# EAGLE design Teensy3 based M&M board V2 (EAGLE 6.4)
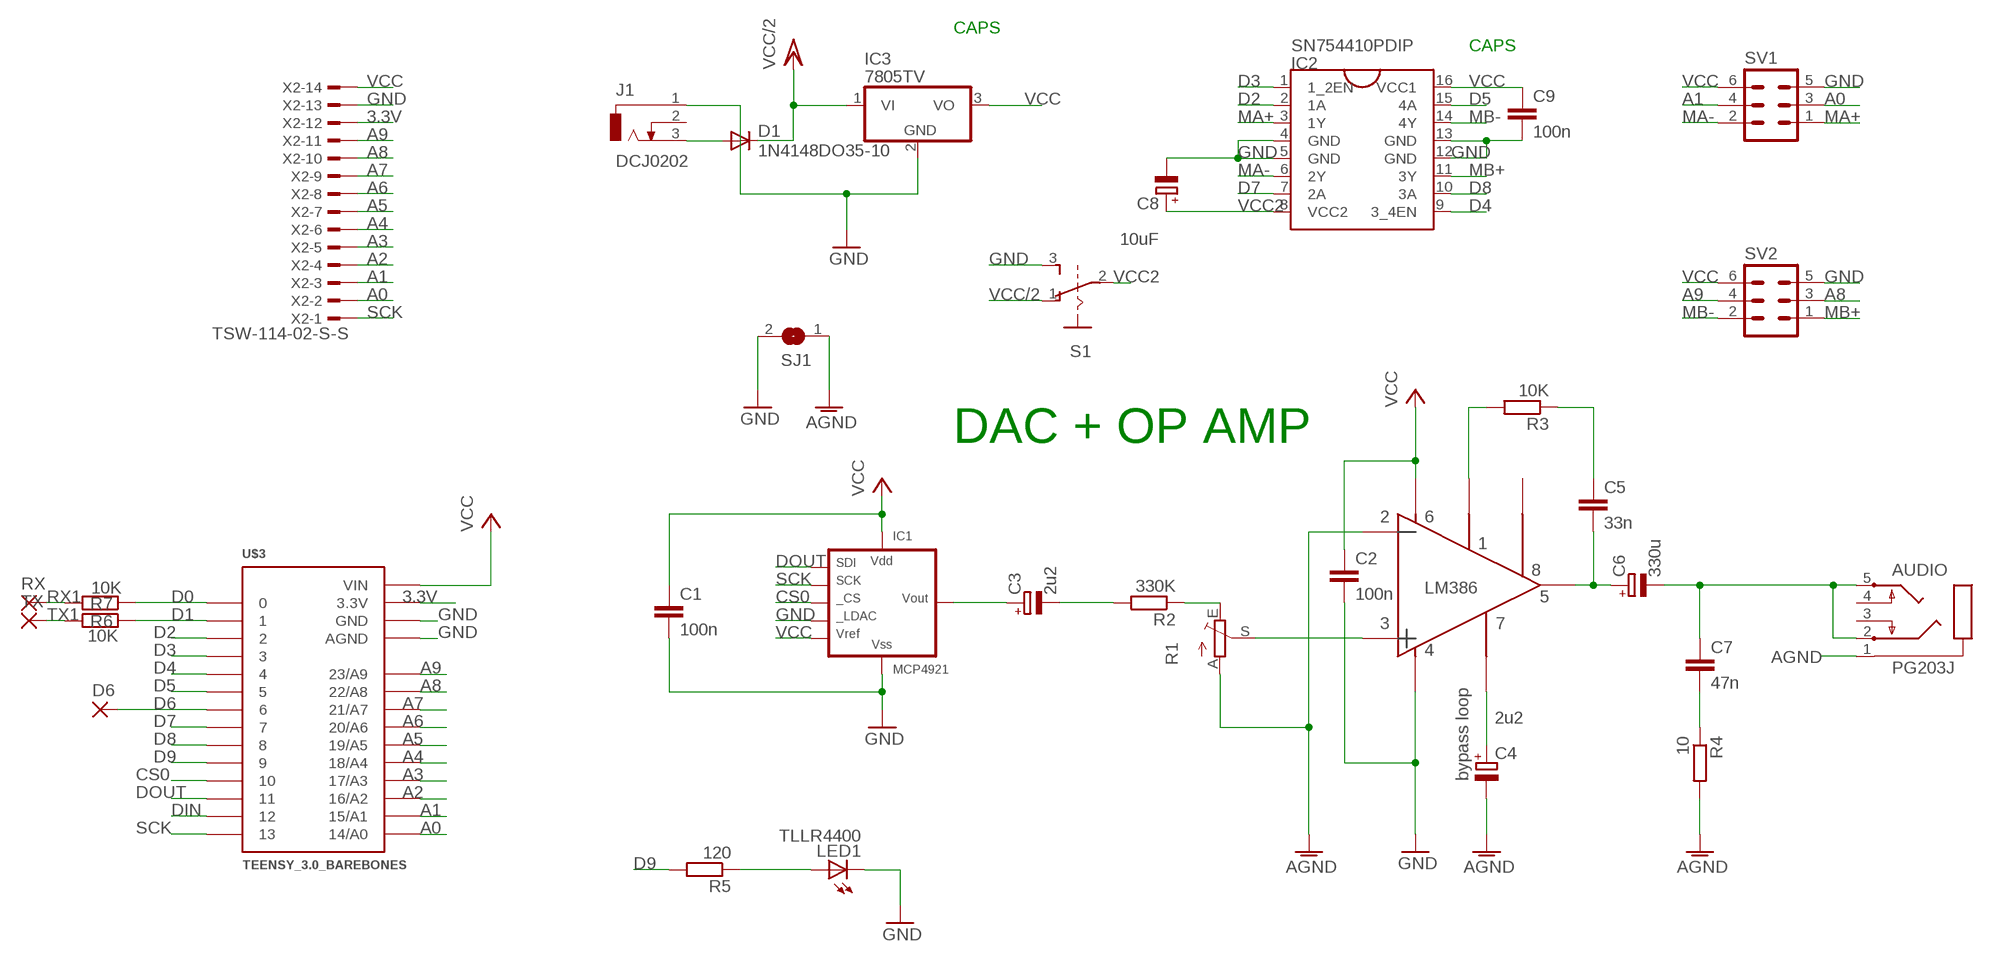
[diagram p0: schematic, sheet 1]

## Parts
AUDIO  PG203J  [PG203J]
C1  100n  C-EU050-030X075  [C050-030X075]
C2  100n  C-EU050-030X075  [C050-030X075]
C3  2u2  CPOL-EUE2-5  [E2-5]
C4  2u2  CPOL-EUE2-5  [E2-5]
C5  33n  C-EU050-030X075  [C050-030X075]
C6  330u  CPOL-EUE2.5-7  [E2,5-7]
C7  47n  C-EU050-030X075  [C050-030X075]
C8  10uF  CPOL-EUE2-5  [E2-5]
C9  100n  C-EU050-030X075  [C050-030X075]
D1  1N4148DO35-10  [DO35-10]
D6  2,15/1,0  [2,15/1,0]
IC1  MCP4921  MCP4921P  [DIL8]
IC2  SN754410PDIP  [DIL16]
IC3  7805TV  [TO220V]
J1  DCJ0202  [DCJ0202]
LED1  TLLR4400  [LED3MM]
R1  TRIM_EU-CA9V  [CA9V]
R2  330K  R-EU_0207/10  [0207/10]
R3  10K  R-EU_0207/10  [0207/10]
R4  10  R-EU_0207/10  [0207/10]
R5  120  R-EU_0207/10  [0207/10]
R6  10K  R-EU_0207/10  [0207/10]
R7  10K  R-EU_0207/10  [0207/10]
RX  2,15/1,0  [2,15/1,0]
S1  EG1218  [GF-126-0159]
SJ1  SJ  [SJ]
SV1  ML6  [ML6]
SV2  ML6  [ML6]
TX  2,15/1,0  [2,15/1,0]
U$2  LM386  LM386OA  [LM386]
U$3  TEENSY_3.0_BAREBONES  [TEENSY_3.0_BAREBONES]
X2  TSW-114-02-S-S  [TSW-114-02-S-S]

## Nets
3.3V [power]: U$3.3.3V X2.12
A0: SV1.3 U$3.14/A0 X2.2
A1: SV1.4 U$3.15/A1 X2.3
A2: U$3.16/A2 X2.4
A3: U$3.17/A3 X2.5
A4: U$3.18/A4 X2.6
A5: U$3.19/A5 X2.7
A6: U$3.20/A6 X2.8
A7: U$3.21/A7 X2.9
A8: SV2.3 U$3.22/A8 X2.10
A9: SV2.4 U$3.23/A9 X2.11
AGND [power]: AUDIO.1 C4.- R1.A R4.2 SJ1.1 U$2.2
AMP_IN: R1.S U$2.3
CS0: IC1.2(CS) U$3.10
D0: R7.1 U$3.0
D1: R6.1 U$3.1
D2: IC2.2(1A) U$3.2
D3: IC2.1(1_2EN) U$3.3
D4: IC2.9(3_4EN) U$3.4
D5: IC2.15(4A) U$3.5
D6: D6.1(P) U$3.6
D7: IC2.7(2A) U$3.7
D8: IC2.10(3A) U$3.8
D9: R5.2 U$3.9
DAC_OUT: C3.+ IC1.8(VOUT)
DIN: U$3.12
DOUT: IC1.4(SDI) U$3.11
GND [power]: C1.2 C2.2 C8.- C9.2 IC1.5(LDAC) IC1.7(VSS) IC2.4(GND) IC2.5(GND) IC2.12(GND) IC2.13(GND) IC3.2(GND) J1.1 LED1.K(C) S1.3 SJ1.2 SV1.5 SV2.5 U$2.4 U$3.AGND U$3.GND X2.13
MA+: IC2.3(1Y) SV1.1
MA-: IC2.6(2Y) SV1.2
MB+: IC2.11(3Y) SV2.1
MB-: IC2.14(4Y) SV2.2
N$1: D1.A J1.3
N$2: R3.2 U$2.1
N$3: C3.- R2.2
N$4: R1.E R2.1
N$5: LED1.A R5.1
N$9: C5.1 R3.1
N$10: C4.+ U$2.7
N$78: C7.2 R4.1
N$84: AUDIO.2 AUDIO.5 C6.- C7.1
N$99: C5.2 C6.+ U$2.5
RX1: R7.2 RX.1(P)
SCK: IC1.3(SCK) U$3.13 X2.1
TX1: R6.2 TX.1(P)
VCC [power]: C1.1 C2.1 C9.1 IC1.1(VDD) IC1.6(VREF) IC2.16(VCC1) IC3.3(VO) SV1.6 SV2.6 U$2.6 U$3.VIN X2.14
VCC2: C8.+ IC2.8(VCC2) S1.2
VCC/2: D1.C IC3.1(VI) S1.1
Unconnected: AUDIO.3 AUDIO.4 J1.2 U$2.8

## Notes on the sheet
- CAPS
- CAPS
- DAC + OP AMP
- bypass loop

## Library data of the parts
AUDIO = con-hirschmann:PG203J: MIC/HEADPHONE JACK KS-S stereo microphone/headphone jack PG203JN (Schukat)
C1 C2 C5 C7 C9 = rcl:C-EU: CAPACITOR, European symbol
C3 C4 C6 C8 = rcl:CPOL-EU: POLARIZED CAPACITOR, European symbol
D1 = diode:1N4148: DIODE high speed (Philips)
D6 RX TX = wirepad:2,15/1,0: THROUGH-HOLE PAD
IC1 = microchip-dac:MCP4921: MCP4921: 12-bit DAC MCP4901/4911/4921 - 8/10/12-Bit Voltage Output Digital-to-Analog Converter with SPI Interface Interface The MCP49x1 devices are single channel 8-bit, 10-bit and 12-bit buffered voltage output Digital-to-Analog Converters (DACs), respectively. The devices operate from a single 2.7V to 5.5V supply with an SPI compatible Serial Peripheral Interface. The user can configure the full-scale range of the device to be VREF or 2*VREF by setting the Gain Selection Option bit (gain of 1 of 2). RobG
IC2 = AlexW-Eagle-Libraries:SN754410
IC3 = linear:78*: Positive VOLTAGE REGULATOR Source: http://cache.national.com/ds/LM/LM78L05.pdf http://www.fairchildsemi.com/ds/LM/LM7805.pdf
J1 = con-jack:DCJ0202: DC POWER JACK Source: DCJ0202.pdf; OC_FARNELL: unknown; OC_NEWARK: unknown
LED1 = led:TLLR4400: Low Current (2mA) LED 3 mm Tinted Diffused Package color RED Source: Data sheet <http://www.farnell.com/datasheets/391100.pdf>; MF: VISHAY SEMICONDUCTOR; OC_FARNELL: 1612437
R1 = pot:TRIM_EU-: POTENTIOMETER
R2-R7 = rcl:R-EU_: RESISTOR, European symbol
S1 = videomusik:EG1218
SJ1 = jumper:SJ: SMD solder JUMPER
SV1 SV2 = con-harting-ml:ML6: HARTING; OC_FARNELL: unknown; OC_NEWARK: unknown
U$2 = blushingboy_experimental:LM386
U$3 = Teensy3.0:TEENSY_3.0_BAREBONES
X2 = con-samtec:TSW-114-02-S-S: THROUGH-HOLE .025" SQ POST HEADER Source: Samtec TSW.pdf; OC_FARNELL: unknown; OC_NEWARK: unknown

## Net classes
1 power: width 0.61 mm

## Board
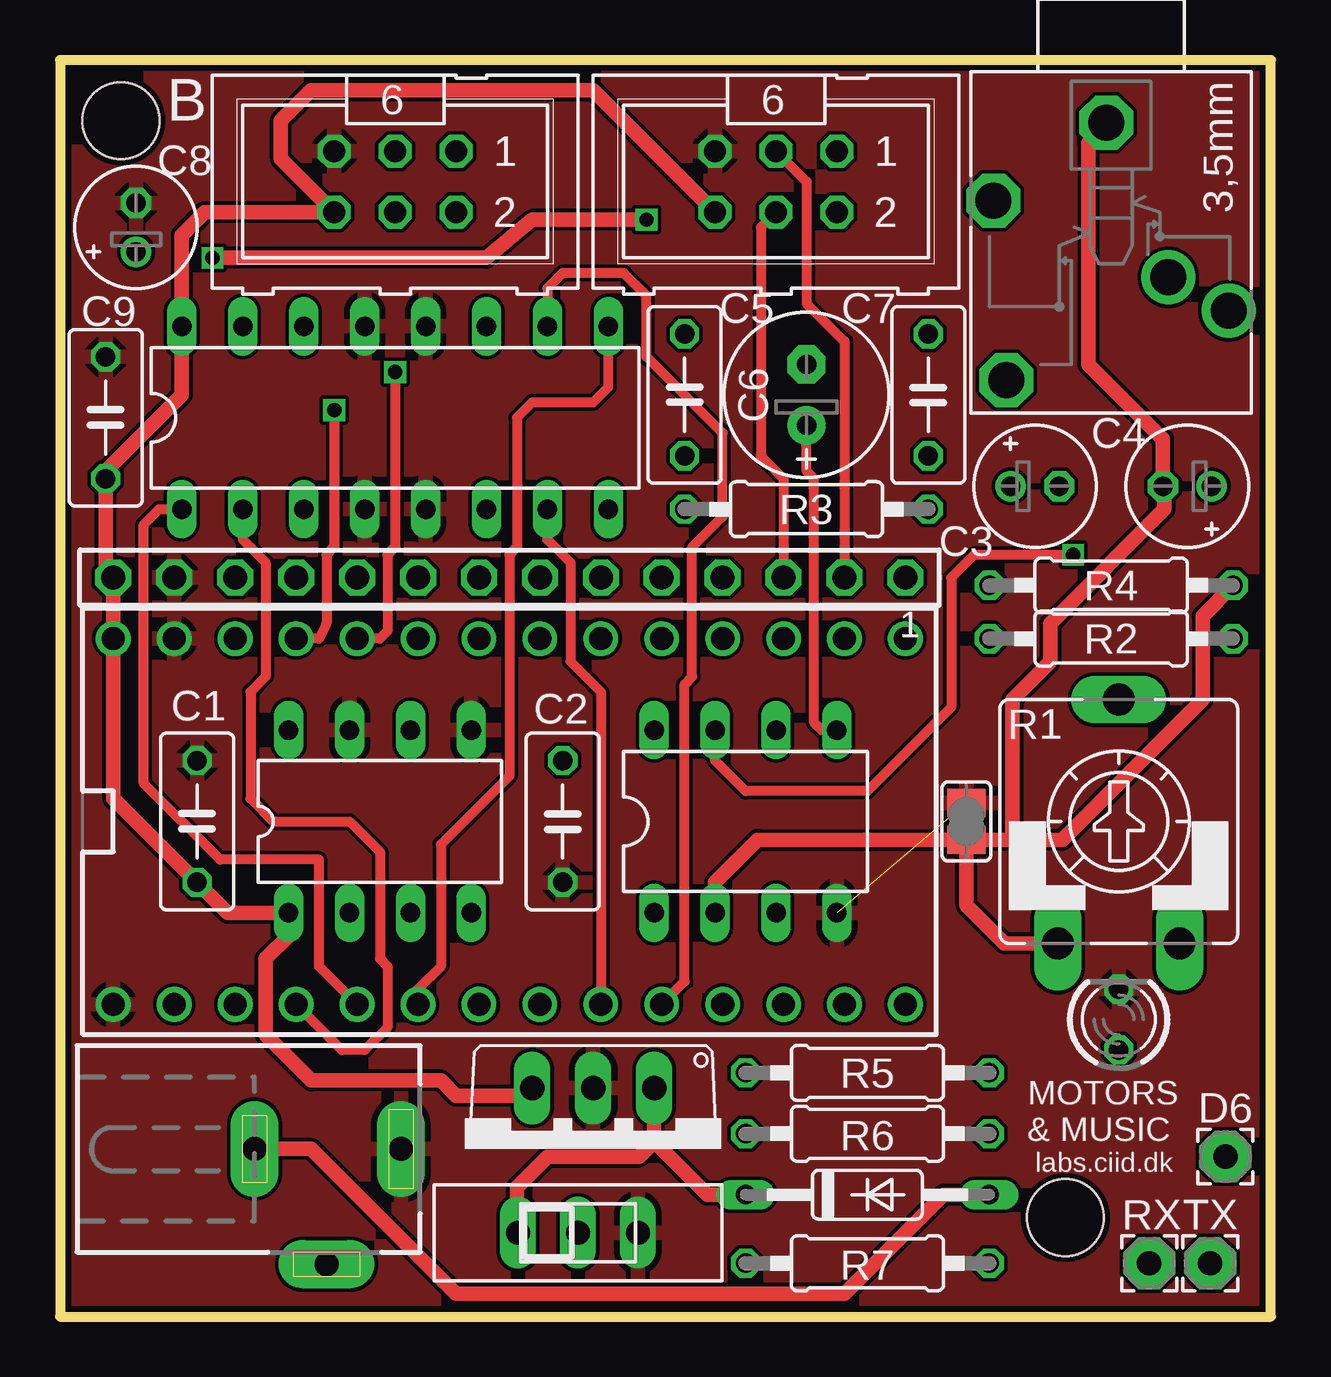
[diagram p1: board, top side]
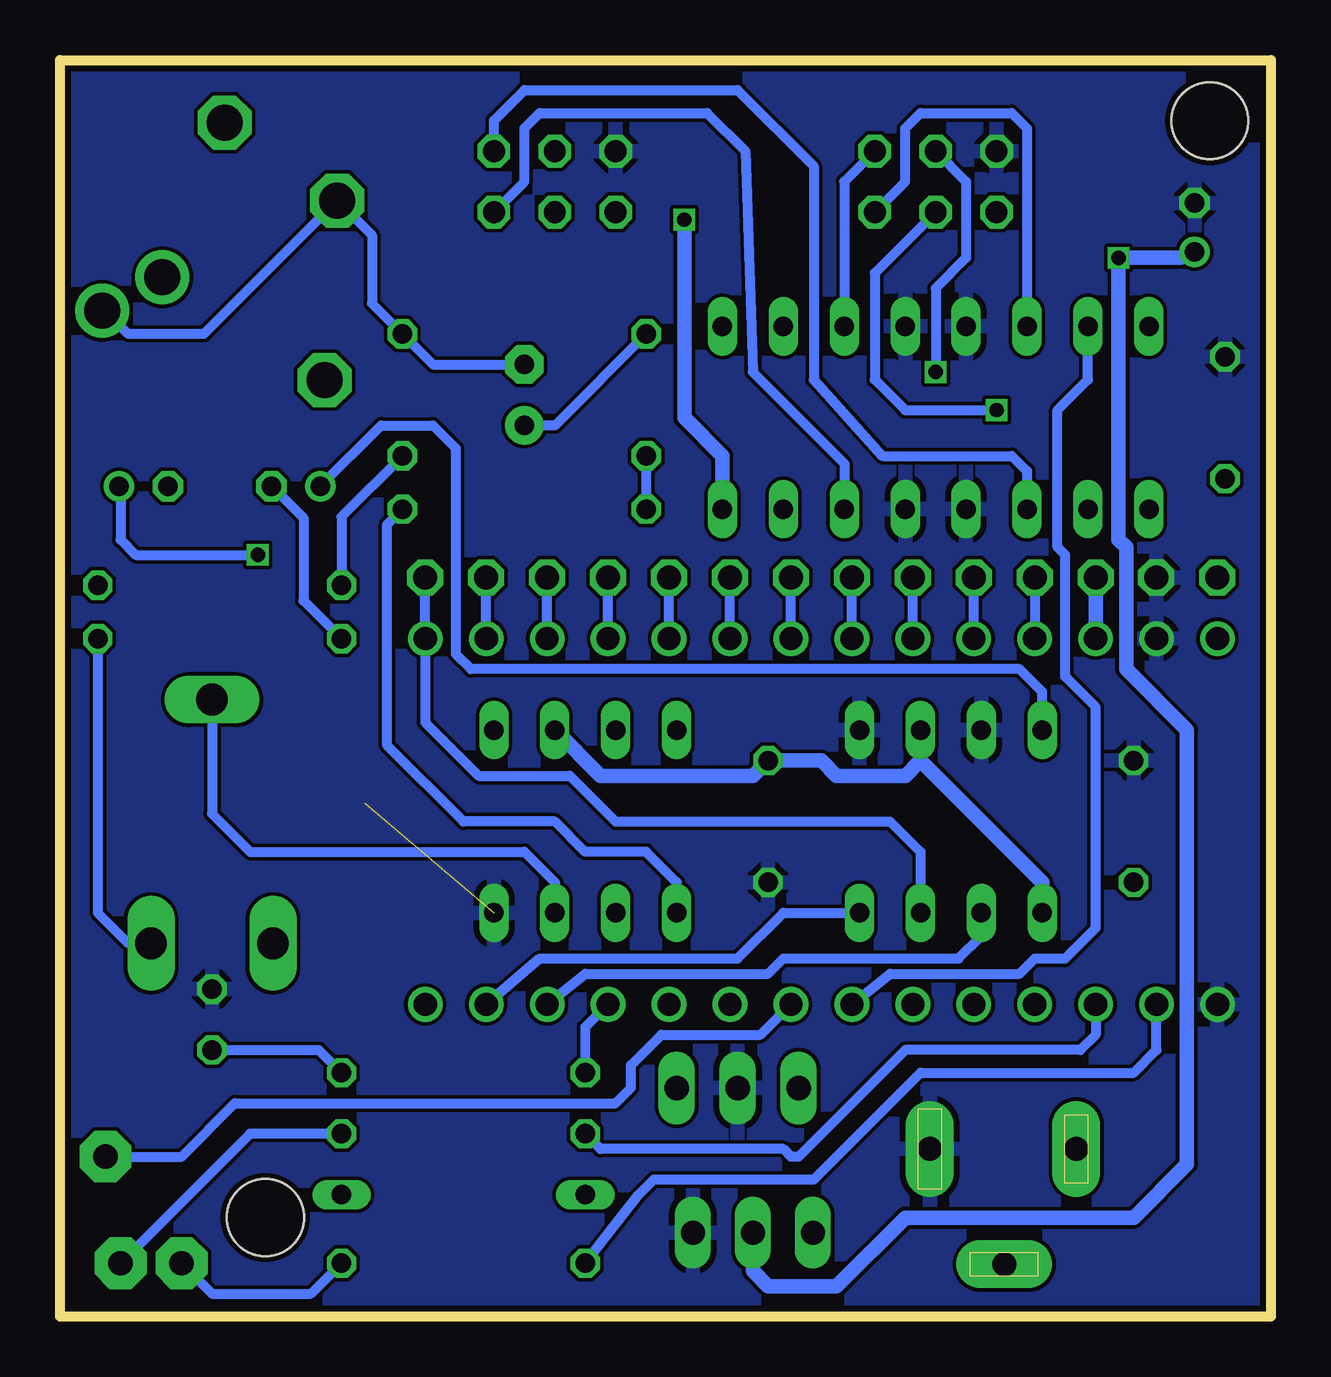
[diagram p2: board, bottom side, seen from below]

Size 50.47 x 52.38 mm. Coordinates in mm from the lower left corner, seen from the top.
Outline: 0,0 50.47,0 50.47,52.38 0,52.38 0,0
Copper layers (1*2*15*16): Top 0.035mm / dielectric 0.2mm / layer 2 0.0175mm / dielectric 1.1mm / layer 15 0.0175mm / dielectric 0.2mm / Bottom 0.035mm
Design rules "SeeedStudio_DRU_no_angle_20130527": minimum track width 6mil, minimum drill 12mil, track to track 6mil, track to pad 6mil, pad to pad 6mil, via to via 6mil, smd to smd 0mil, copper to edge 10mil, drill to drill 10mil, minimum pad ring 6mil, minimum via ring 6mil, stop-mask expansion 2mil, vias tented up to drill 25mil, thermal gap 10mil
Holes 3.2 mm at 2.54,49.85 41.91,4.13

### Footprints (pad centres in the part's own frame; a part is rotated, then mirrored left to right if it is on the bottom)
PG203J = drill 1.499 octagon: 1 -5.004,-0.203; 4 5.74,-4.369; 5 -1.753,-4.902 | drill 1.499: 2 2.845,4.902; 3 1.448,2.388
C050-030X075 = drill 0.813 octagon: 1 -2.54,0; 2 2.54,0
E2-5 = drill 0.813 pad 1.27: + -1.016,0 | drill 0.813 pad 1.27 octagon: - 1.016,0
E2,5-7 = drill 0.813 pad 1.6: + -1.27,0 | drill 0.813 pad 1.6 octagon: - 1.27,0
DO35-10 = drill 0.813 long: A 5.08,0; C -5.08,0
2,15/1,0 = drill 1.016 pad 2.159 octagon: 1 0,0
DIL8 = drill 0.813 long: 1 -3.81,-3.81; 2 -1.27,-3.81; 3 1.27,-3.81; 4 3.81,-3.81; 5 3.81,3.81; 6 1.27,3.81; 7 -1.27,3.81; 8 -3.81,3.81
DIL16 = drill 0.813 long: 1 -8.89,-3.81; 2 -6.35,-3.81; 3 -3.81,-3.81; 4 -1.27,-3.81; 5 1.27,-3.81; 6 3.81,-3.81; 7 6.35,-3.81; 8 8.89,-3.81; 9 8.89,3.81; 10 6.35,3.81; 11 3.81,3.81; 12 1.27,3.81; 13 -1.27,3.81; 14 -3.81,3.81; 15 -6.35,3.81; 16 -8.89,3.81
TO220V = drill 1.016 long: 1 -2.54,-2.54; 2 0,-2.54; 3 2.54,-2.54
DCJ0202 = drill 1 pad 2 long: 1 0,3.1; 2 4.8,0; 3 0,-3
LED3MM = drill 0.813 octagon: A -1.27,0; K 1.27,0
CA9V = drill 1.321 long: A -2.54,-5.08; E 2.54,-5.08; S 0,5.08
0207/10 = drill 0.813 octagon: 1 -5.08,0; 2 5.08,0
GF-126-0159 = drill 1 long: 1 -2.5,0; 2 0,0; 3 2.5,0
SJ = smd 1.168 x 1.6: 1 -0.762,0; 2 0.762,0
ML6 = drill 0.914 octagon: 1 -2.54,-1.27; 2 -2.54,1.27; 3 0,-1.27; 4 0,1.27; 5 2.54,-1.27; 6 2.54,1.27
LM386 = drill 0.813 long: 1 2.54,-2.54; 2 5.08,-2.54; 3 7.62,-2.54; 4 10.16,-2.54; 5 10.16,5.08; 6 7.62,5.08; 7 5.08,5.08; 8 2.54,5.08
TEENSY_3.0_BAREBONES = drill 0.965: 0 -7.62,13.97; 1 -7.62,11.43; 2 -7.62,8.89; 3 -7.62,6.35; 3.3V 7.62,11.43; 4 -7.62,3.81; 5 -7.62,1.27; 6 -7.62,-1.27; 7 -7.62,-3.81; 8 -7.62,-6.35; 9 -7.62,-8.89; 10 -7.62,-11.43; 11 -7.62,-13.97; 12 -7.62,-16.51; 13 7.62,-16.51; 14/A0 7.62,-13.97; 15/A1 7.62,-11.43; 16/A2 7.62,-8.89; 17/A3 7.62,-6.35; 18/A4 7.62,-3.81; 19/A5 7.62,-1.27; 20/A6 7.62,1.27; 21/A7 7.62,3.81; 22/A8 7.62,6.35; 23/A9 7.62,8.89; AGND 7.62,13.97; GND -7.62,16.51; VIN 7.62,16.51
TSW-114-02-S-S = drill 1 pad 1.5 octagon: 1 16.51,0; 2 13.97,0; 3 11.43,0; 4 8.89,0; 5 6.35,0; 6 3.81,0; 7 1.27,0; 8 -1.27,0; 9 -3.81,0; 10 -6.35,0; 11 -8.89,0; 12 -11.43,0; 13 -13.97,0; 14 -16.51,0

### Placement (x,y rotation side)
AUDIO  43.81,44.77 270 top
C1  5.71,20.64 90 top
C2  20.95,20.64 270 top
C3  40.64,34.61 0 top
C4  46.99,34.61 180 top
C5  26.04,38.42 90 top
C6  31.11,38.42 90 top
C7  36.2,38.42 270 top
C8  3.17,45.4 90 top
C9  1.91,37.47 90 top
D1  33.66,5.08 0 top
D6  48.58,6.67 0 top
IC1  13.34,20.64 0 top
IC2  13.97,37.47 0 top
IC3  22.23,6.99 180 top
J1  11.11,6.99 270 top
LED1  44.13,12.38 90 top
R1  44.13,20.64 0 top
R2  43.81,28.26 180 top
R3  31.11,33.66 0 top
R4  43.81,30.48 0 top
R5  33.66,10.16 180 top
R6  33.66,7.62 0 top
R7  33.66,2.22 0 top
RX  45.4,2.22 0 top
S1  21.59,3.49 0 top
SJ1  37.78,20.64 90 top
SV1  29.84,47.31 180 top
SV2  13.97,47.31 180 top
TX  47.94,2.22 0 top
U$2  22.23,19.37 0 top
U$3  18.73,20.64 90 top
X2  18.73,30.8 0 top

### Tracks (layer width: path | path; a pad name or v marks a point on that pad's centre or on a via)
3.3V
  Bottom 0.61: X2.12 U$3.3.3V
A0
  Top 0.406: SV1.3 31.11,47.31 31.11,42.23 32.7,40.64 X2.2
  Bottom 0.406: U$3.14/A0 X2.2
A1
  Top 0.406: SV1.4 29.21,45.4 29.21,35.88 30.16,34.92 X2.3
  Bottom 0.406: U$3.15/A1 X2.3
A2
  Bottom 0.406: U$3.16/A2 X2.4
A3
  Bottom 0.406: U$3.17/A3 X2.5
A4
  Bottom 0.406: U$3.18/A4 X2.6
A5
  Bottom 0.406: U$3.19/A5 X2.7
A6
  Bottom 0.406: U$3.20/A6 X2.8
A7
  Bottom 0.406: U$3.21/A7 X2.9
A8  (via drill 0.6)
  Top 0.406: v13.97,39.37 13.97,32.07 13.65,31.75 13.65,28.57 13.34,28.26 U$3.22/A8
  Bottom 0.406: SV2.3 12.7,47.31 12.7,44.13 13.97,42.86 v13.97,39.37 | U$3.22/A8 X2.10
A9  (via drill 0.6)
  Top 0.406: v11.43,37.78 11.43,32.07 11.11,31.75 11.11,28.89 10.79,28.26 U$3.23/A9
  Bottom 0.406: SV2.4 16.51,43.5 16.51,39.05 15.24,37.78 v11.43,37.78 | X2.11 U$3.23/A9
AGND
  Top 0.61: U$2.2 27.3,18.1 29.08,19.88 SJ1.1 | AUDIO.1 42.86,48.93 42.86,39.69 45.97,36.58 C4.- 46.04,34.54 46.04,33.66 41.27,28.89 41.27,27.3 39.69,25.72 39.69,19.88 | R1.A 39.37,15.56 37.78,17.14 SJ1.1 | R4.2 47.62,29.21 47.62,25.72 41.78,19.88 39.69,19.88 | 39.69,19.88 SJ1.1
AMP_IN
  Bottom 0.406: R1.S 44.13,20.95 42.55,19.37 31.11,19.37 29.84,18.1 U$2.3
CS0
  Bottom 0.406: U$3.10 28.57,14.29 20.95,14.29 20.32,14.92 13.02,14.92 12.06,15.88 IC1.2
D0
  Bottom 0.406: R7.1 26.35,5.08 25.72,5.71 19.05,5.71 14.61,10.16 5.71,10.16 4.76,11.11 U$3.0
D1
  Bottom 0.406: U$3.1 7.3,11.75 7.94,11.11 15.24,11.11 19.68,6.67 20,6.67 20.32,6.99 27.94,6.99 R6.1
D2
  Top 0.406: IC2.2 7.62,32.38 8.57,31.43 8.57,26.67 7.94,26.04 7.94,21.59 8.89,20.64 12.06,20.64 13.34,19.37 13.34,14.92 13.65,14.61 13.65,12.06 12.7,11.11 11.75,11.11 U$3.2
D3
  Top 0.406: U$3.3 10.79,14.61 10.79,19.05 6.67,19.05 3.49,22.23 3.49,33.02 4.13,33.66 IC2.1
D4
  Top 0.406: U$3.4 14.92,13.65 15.88,14.61 15.88,19.68 18.73,22.54 18.73,31.75 19.05,32.07 19.05,37.47 19.68,38.1 22.23,38.1 22.86,38.73 IC2.9
D5
  Bottom 0.406: U$3.5 15.88,14.29 10.48,14.29 9.84,14.92 8.57,14.92 7.3,16.19 7.3,25.4 8.57,26.67 8.57,31.75 8.89,32.07 8.89,37.78 7.62,39.05 IC2.15
D6
  Bottom 0.406: U$3.6 21.27,11.75 25.4,11.75 26.67,10.48 26.67,9.53 27.3,8.89 43.18,8.89 45.4,6.67 D6.1
D7
  Top 0.406: IC2.7 20.32,32.38 21.27,31.43 21.27,27.3 22.54,26.04 U$3.7
D8
  Top 0.406: U$3.8 26.04,13.97 26.04,26.35 26.35,26.67 26.35,32.07 27.62,33.34 27.62,36.83 24.45,40.01 24.45,42.55 23.5,43.5 20.95,43.5 20.32,42.86 IC2.10
D9
  Bottom 0.406: U$3.9 28.57,12.06 R5.2
DAC_OUT
  Bottom 0.406: IC1.8 9.53,26.04 10.48,26.99 33.34,26.99 33.97,27.62 33.97,36.2 34.92,37.15 37.08,37.15 C3.+
DOUT
  Bottom 0.406: U$3.11 30.48,14.92 22.23,14.92 20.32,16.83 IC1.4
GND  (1 unrouted)
  pour Bottom: -1.91,-0.95 -1.91,53.66 50.8,53.66 50.8,-0.95
  pour Top: -0.95,53.02 -0.95,-0.95 50.8,-0.95 50.8,53.02
MA+
  Bottom 0.406: SV1.1 32.38,49.85 31.11,51.12 22.23,51.12 19.05,47.94 19.05,39.05 16.19,35.88 10.79,35.88 10.16,35.24 IC2.3
MA-
  Bottom 0.406: SV1.2 31.11,47.31 31.11,49.53 30.48,50.16 23.5,50.16 21.91,48.58 21.59,39.37 17.78,35.56 IC2.6
MB+
  Bottom 0.406: SV2.1 17.78,47.31 IC2.11
MB-
  Bottom 0.406: SV2.2 15.24,47.31 15.24,49.53 14.61,50.16 10.79,50.16 10.16,49.53 IC2.14
N$1
  Top 0.61: D1.A 36.83,5.08 32.7,0.95 16.51,0.95 10.48,6.99 J1.3
N$2
  Bottom 0.406: U$2.1 24.77,18.1 26.04,19.37 28.57,19.37 29.84,20.64 33.66,20.64 36.83,23.81 36.83,33.02 R3.2
N$3
  Bottom 0.406: C3.- 40.32,33.27 40.32,29.84 R2.2
N$4
  Bottom 0.406: R2.1 48.9,16.83 47.62,15.56 R1.E
N$5
  Bottom 0.406: LED1.A 39.69,11.11 R5.1
N$9
  Bottom 0.406: C5.1 R3.1
N$10  (via drill 0.6)
  Top 0.406: U$2.7 27.3,23.18 28.57,21.91 33.66,21.91 37.15,25.4 37.15,30.8 38.1,31.75 v42.23,31.75
  Bottom 0.406: C4.+ 47.94,34.54 47.94,32.38 47.31,31.75 v42.23,31.75
N$78
  Bottom 0.406: C7.2 38.73,33.34 R4.1
N$84
  Bottom 0.406: AUDIO.2 48.59,41.92 47.62,40.96 44.48,40.96 AUDIO.5 37.47,45.07 37.47,42.23 C7.1 34.92,39.69 C6.-
N$99
  Top 0.406: U$2.5 31.75,24.45 31.43,24.77 31.43,34.92 31.11,35.24 C6.+
  Bottom 0.406: C5.2 29.84,37.15 C6.+
RX1
  Bottom 0.406: RX.1 44.13,0.95 40.01,0.95 R7.2
SCK
  Bottom 0.406: IC1.3 14.61,19.37 15.88,20.64 27.3,20.64 29.21,22.54 33.02,22.54 35.24,24.77 U$3.13 X2.1
TX1
  Bottom 0.406: R6.2 42.55,7.62 TX.1
VCC
  Top 0.61: SV1.6 22.23,51.12 10.48,51.12 9.21,49.85 9.21,48.26 SV2.6 6.03,46.04 5.08,45.09 IC2.16 5.08,38.42 1.91,35.24 C9.1 1.91,31.11 X2.14 U$3.VIN 2.22,21.59 C1.1 6.99,16.83 IC1.1 9.53,15.88 8.57,14.92 8.57,11.75 10.48,9.84 15.88,9.84 16.51,9.21 19.37,9.21 IC3.3
  Bottom 0.61: U$2.6 27.94,22.54 21.59,22.54 C2.1 18.73,23.18 18.1,22.54 15.24,22.54 14.61,23.18 | IC1.6 14.61,23.18 | 14.61,23.18 9.53,18.1 IC1.1
VCC2  (via drill 0.6)
  Top 0.61: v24.45,45.72 19.68,45.72 17.78,44.13 v6.35,44.13
  Bottom 0.61: S1.2 21.59,1.91 20.95,1.27 18.1,1.27 15.24,4.13 5.71,4.13 3.49,6.35 3.49,24.45 6.03,26.99 6.03,32.07 6.35,32.38 v6.35,44.13 3.75,44.13 C8.+ | IC2.8 22.86,35.88 24.45,37.47 v24.45,45.72
VCC/2
  Top 0.406: S1.1 19.05,3.53 | 24.77,7.3 24.61,7.14 24.92,7.14
  Top 0.61: 19.05,3.53 19.05,5.4 20.32,6.67 24.13,6.67 24.61,7.14 | 24.77,7.3 IC3.1 | D1.C 26.99,5.08 24.92,7.14

### Text on the board
tNames: B | MOTORS / & MUSIC | labs.ciid.dk